# Altium schematic sheet CAN-Bus.SchDoc
size A4; CheckedBy: <审核人员>; PageSetup: Record=PageOptions|CenterHorizontal=True|CenterVertical=True|PrintScale=1.00|XCorrection=1.00|YCorrection=1.00|PrintKind=0|BorderSize=5000000|LeftOffset=0|BottomOffset=0|Orientation=2|PaperLength=1000|PaperWidth=1000|Scale=100|PaperSource=7|PrintQuality=600|MediaType=1|DitherType=10|PaperKind=A4|PrintScaleMode=1; DesignDate: 2013-12-26; CheckDate: <审核日期>; SheetName: CAN-Bus; SheetVersion: V1.01
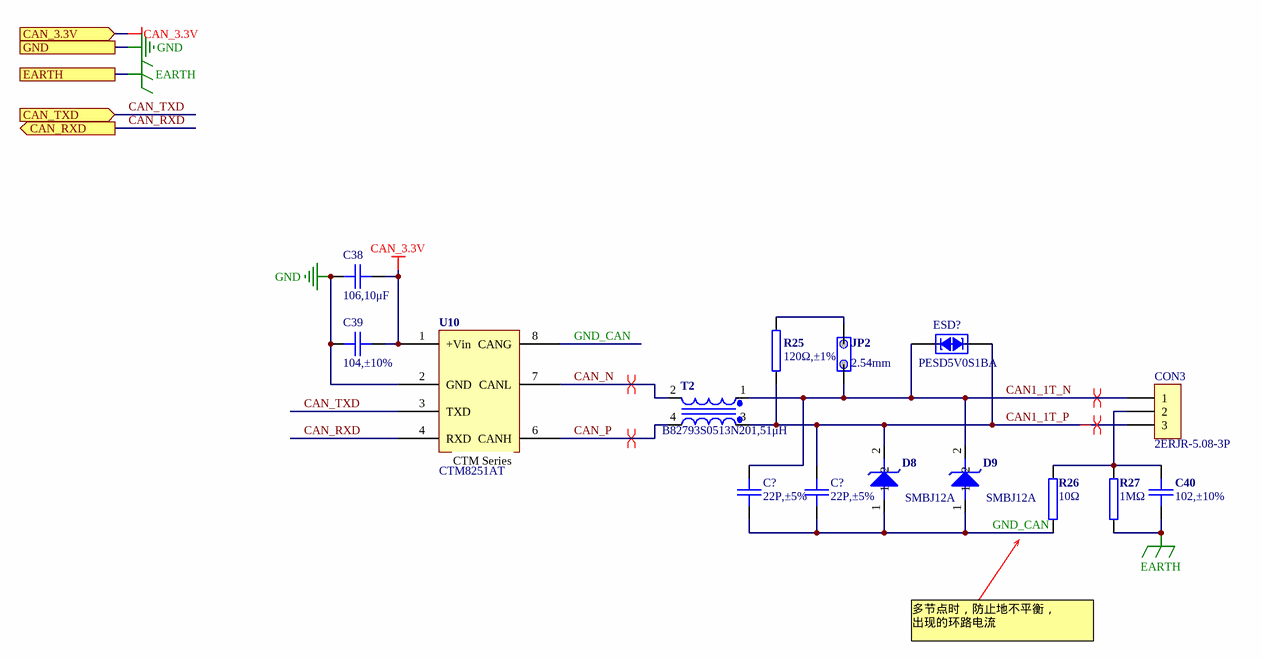
[diagram p0: CAN-Bus.SchDoc]

## Parts
(Parts that share a designator on the sheet are numbered #1, #2 ... from top to bottom, then left to right.)
C38  106,10μF  [0805C]
C39  104,±10%  [0603C]
C40  102,±10%  [1206C]
C?#1  22P,±5%  [0603C]
C?#2  22P,±5%  [0603C]
CON3  value 2ERJR-5.08-3P  [CON-3-5.08]  (hidden comment: CON3)
D8  value SMBJ12A  [SOD-1812D]  (hidden comment: DIODE ZENER)
D9  value SMBJ12A  [SOD-1812D]  (hidden comment: DIODE ZENER)
ESD?  value PESD5V0S1BA  [SOD-323]  (hidden comment: ESD-1)
JP2  2.54mm  [SIP-2]
R25  120Ω,±1%  [1206R]
R26  10Ω  [0805R]
R27  1MΩ  [1206R]
T2  value B82793S0513N201,51μH  [L-S513]  (hidden comment: Trans Eq)
U10  CTM8251AT  [CTM Series]

## Ports
CAN_3.3V, CAN_RXD (out), CAN_TXD (in), EARTH, GND

## Nets
CAN_3.3V: C38.2 C39.2 U10.1(+Vin) ; port CAN_3.3V
EARTH: C40.2 R27.2 ; port EARTH
GND: C38.1 C39.1 U10.2(GND) ; port GND
CAN1_1T_N: C?#1.1 CON3.1 D9.2 ESD?.1 JP2.1 T2.1
CAN1_1T_P: C?#2.1 CON3.3 D8.2 ESD?.2 R25.1 T2.3
CAN_N: T2.2 U10.7(CANL)
CAN_P: T2.4 U10.6(CANH)
CAN_RXD: U10.4(RXD) ; port CAN_RXD
CAN_TXD: U10.3(TXD) ; port CAN_TXD
GND_CAN: C?#1.2 C?#2.2 D8.1 D9.1 R26.1 U10.8(CANG)
NetC40_1: C40.1 CON3.2 R26.2 R27.1
NetJP2_2: JP2.2 R25.2

## Layout directives
differential pair: CAN1_1T_N, CAN1_1T_P, CAN_N, CAN_P

## Notes on the sheet
- 多节点时，防止地不平衡，
  出现的环路电流
- 1
- #
- 修改日期
- 修改内容
- 2
- 3
- 广州致远电子股份有限公司
- 设计人员
- 审核人员
- 设计日期
- 审核日期
- 产品名称
- 图纸名称
- 产品型号
- 图纸描述
- 图纸版本
- A4

## Library data of the parts
C38 = 1.02.02.0055: 106,10μF,±10%,10V,X5R,0805,RoHS; 名称: 电容; 封装: 0805; 设备封装名称: C0805_106_X5R_10V_10%; 贴片和直插: SMT; 物料代码: 1.02.02.0055; Value: 106,10μF; RoHS: RoHS; 型号: 106,10μF,±10%,10V,X5R; ComponentLink1Description: ErpDataInfo; ComponentLink1URL: http://erp.zlgmcu.com/ErpExt/ErpData/ListMateriel.aspx?pkey=1.02.02.0055
C39 = 1.02.01.0032: 104,±10%,50V,X7R,0603,*,RoHS; 名称: 电容; 封装: 0603; 设备封装名称: C0603_104_X7R_50V_10%; 贴片和直插: SMT; 物料代码: 1.02.01.0032; Value: 104,±10%; RoHS: RoHS; 型号: 104,±10%,50V,X7R,0603,*,RoHS; ComponentLink1Description: ErpDataInfo; ComponentLink1URL: http://erp.zlgmcu.com/ErpExt/ErpData/ListMateriel.aspx?pkey=1.02.01.0032
C40 = 1.02.03.0003: Capacitor; 名称: 电容; 规格型号: 102,±10%,2KV,X7R,1206,*,RoHS; 现有库存: 26517; 封装: 1206; 设备封装名称: C1206_102_X7R_2KV_10%; 贴片和直插: SMT; 物料代码: 1.02.03.0003; Value: 102,±10%; ComponentLink1Description: ErpDataInfo; ComponentLink1URL: http://erp.zlgmcu.com/ErpExt/ErpData/ListMateriel.aspx?pkey=1.02.03.0003; RoHS: RoHS
C?#1 C?#2 = 1.02.01.0005: 22P,±5%,50V,COG,0603,*,RoHS; 名称: 电容; 封装: 0603; 设备封装名称: C0603_22P_COG_50V_5%; 贴片和直插: SMT; 物料代码: 1.02.01.0005; Value: 22P,±5%; RoHS: RoHS; 型号: 22P,±5%,50V,COG; ComponentLink1Description: ErpDataInfo; ComponentLink1URL: http://erp.zlgmcu.com/ErpExt/ErpData/ListMateriel.aspx?pkey=1.02.01.0005
CON3 = 1.10.06.0170: 2ERJR-5.08-3P; 名称: 端子; 贴片和直插: THT; 器件优选方案: 优先选用; 物料代码: 1.10.06.0170; 型号: 2ERJR-5.08-3P; ComponentLink1Description: ErpDataInfo; ComponentLink1URL: http://erp.zlgmcu.com/ErpExt/ErpData/ListMateriel.aspx?pkey=1.10.06.0170
D8 D9 = 1.04.03.0007: SMBJ12A,DO-214AA,君耀,RoHS; 名称: TVS管; 设备封装名称: DO-214AA_SMBJ12A; 贴片和直插: SMT; 器件优选方案: 优先选用; 物料代码: 1.04.03.0007; 封装: DO-214AA; 厂商: 君耀; RoHS: RoHS; 型号: SMBJ12A; ComponentLink1Description: ErpDataInfo; ComponentLink1URL: http://erp.zlgmcu.com/ErpExt/ErpData/ListMateriel.aspx?pkey=1.04.03.0007
ESD? = 1.05.10.0332: PESD5V0S1BA,SOD-323,NXP,RoHS; 名称: IC; 贴片和直插: SMT; 物料代码: 1.05.10.0332; 封装: SOD-323; 厂商: NXP; RoHS: RoHS; 型号: PESD5V0S1BA; ComponentLink1Description: ErpDataInfo; ComponentLink1URL: http://erp.zlgmcu.com/ErpExt/ErpData/ListMateriel.aspx?pkey=1.05.10.0332
JP2 = JMP2
R25 = 1.01.03.0025: 名称: 电阻; 规格型号: 120Ω,±1%,1206,RoHS; 封装: 1206; 设备封装名称: R1206_120R_1%; 贴片和直插: SMT; 现有库存: 6550; 物料代码: 1.01.03.0025; Value: 120Ω,±1%; RoHS: RoHS; ComponentLink1Description: ErpDataInfo; ComponentLink1URL: http://erp.zlgmcu.com/ErpExt/ErpData/ListMateriel.aspx?pkey=1.01.03.0025
R26 = 1.01.02.0008: 10Ω,0805,*,RoHS; 名称: 电阻; 封装: 0805; 设备封装名称: R0805_10R; 贴片和直插: SMT; 物料代码: 1.01.02.0008; Value: 10Ω; RoHS: RoHS; 型号: 10Ω; ComponentLink1Description: ErpDataInfo; ComponentLink1URL: http://erp.zlgmcu.com/ErpExt/ErpData/ListMateriel.aspx?pkey=1.01.02.0008
R27 = 1.01.03.0019: 名称: 电阻; 规格型号: 1MΩ,1206,RoHS; 现有库存: 12252; 封装: 1206; 设备封装名称: R1206_1M; 贴片和直插: SMT; 物料代码: 1.01.03.0019; Value: 1MΩ; ComponentLink1Description: ErpDataInfo; ComponentLink1URL: http://erp.zlgmcu.com/ErpExt/ErpData/ListMateriel.aspx?pkey=1.01.03.0019; RoHS: RoHS
T2 = 1.03.01.0038: 共模扼流圈; 名称: 扼流圈; 规格型号: B82793S0513N201,51μH,7.1×6.0×4.8mm,EPCOS; 封装: 7.1×6.0×4.8mm; 厂商: EPCOS; 贴片和直插: SMT; 现有库存: 1096; Published: 8-Jun-2000; LatestRevisionDate: 17-Jul-2002; LatestRevisionNote: Re-released for DXP Platform.; Publisher: Altium Limited; 物料代码: 1.03.01.0038; ComponentLink1Description: ErpDataInfo; ComponentLink1URL: http://erp.zlgmcu.com/ErpExt/ErpData/ListMateriel.aspx?pkey=1.03.01.0038
U10 = CTM Series: 物料代号: 2.14.01.0897; 规格型号: CTM8251AT V2.03; 名称: 隔离收发器